# EAGLE design Top (EAGLE 9.6.2)
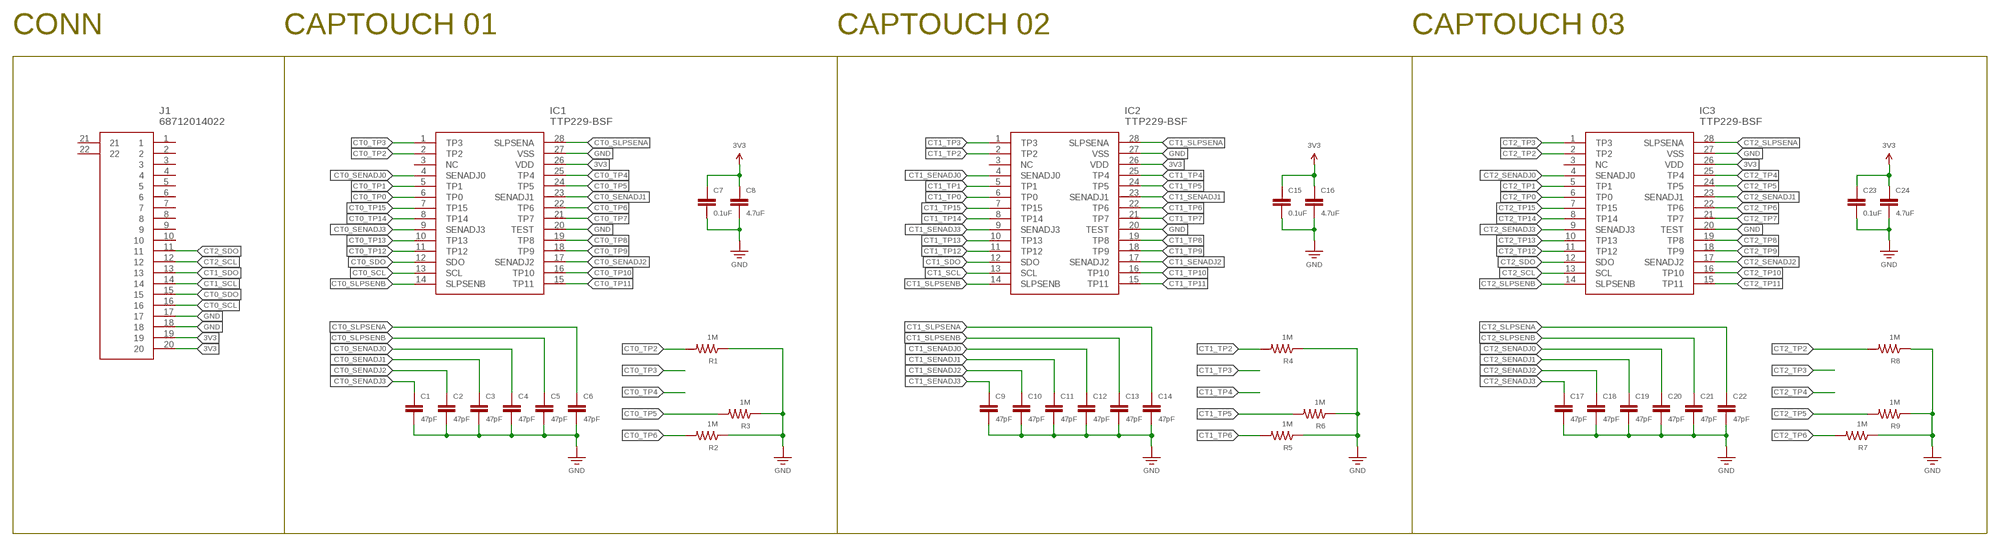
[diagram p0: schematic, sheet 1]

## Parts
C1  47pF  CAP-0603  [CAP-0603]
C2  47pF  CAP-0603  [CAP-0603]
C3  47pF  CAP-0603  [CAP-0603]
C4  47pF  CAP-0603  [CAP-0603]
C5  47pF  CAP-0603  [CAP-0603]
C6  47pF  CAP-0603  [CAP-0603]
C7  0.1uF  CAP-0603  [CAP-0603]
C8  4.7uF  CAP-0603  [CAP-0603]
C9  47pF  CAP-0603  [CAP-0603]
C10  47pF  CAP-0603  [CAP-0603]
C11  47pF  CAP-0603  [CAP-0603]
C12  47pF  CAP-0603  [CAP-0603]
C13  47pF  CAP-0603  [CAP-0603]
C14  47pF  CAP-0603  [CAP-0603]
C15  0.1uF  CAP-0603  [CAP-0603]
C16  4.7uF  CAP-0603  [CAP-0603]
C17  47pF  CAP-0603  [CAP-0603]
C18  47pF  CAP-0603  [CAP-0603]
C19  47pF  CAP-0603  [CAP-0603]
C20  47pF  CAP-0603  [CAP-0603]
C21  47pF  CAP-0603  [CAP-0603]
C22  47pF  CAP-0603  [CAP-0603]
C23  0.1uF  CAP-0603  [CAP-0603]
C24  4.7uF  CAP-0603  [CAP-0603]
IC1  TTP229-BSF  [SOP64P600X175-28N]
IC2  TTP229-BSF  [SOP64P600X175-28N]
IC3  TTP229-BSF  [SOP64P600X175-28N]
J1  68712014022  [68712014022]
R1  1M  RES-0603  [RES-0603]
R2  1M  RES-0603  [RES-0603]
R3  1M  RES-0603  [RES-0603]
R4  1M  RES-0603  [RES-0603]
R5  1M  RES-0603  [RES-0603]
R6  1M  RES-0603  [RES-0603]
R7  1M  RES-0603  [RES-0603]
R8  1M  RES-0603  [RES-0603]
R9  1M  RES-0603  [RES-0603]

## Nets
3V3: C7.P$1 C8.P$1 C15.P$1 C16.P$1 C23.P$1 C24.P$1 IC1.26(VDD) IC2.26(VDD) IC3.26(VDD) J1.19 J1.20
CT0_SCL: IC1.13(SCL) J1.16
CT0_SDO: IC1.12(SDO) J1.15
CT0_SENADJ0: C4.P$1 IC1.4(SENADJ0)
CT0_SENADJ1: C3.P$1 IC1.23(SENADJ1)
CT0_SENADJ2: C2.P$1 IC1.17(SENADJ2)
CT0_SENADJ3: C1.P$1 IC1.9(SENADJ3)
CT0_SLPSENA: C6.P$1 IC1.28(SLPSENA)
CT0_SLPSENB: C5.P$1 IC1.14(SLPSENB)
CT0_TP0: IC1.6(TP0)
CT0_TP1: IC1.5(TP1)
CT0_TP2: IC1.2(TP2) R1.P$2
CT0_TP3: IC1.1(TP3)
CT0_TP4: IC1.25(TP4)
CT0_TP5: IC1.24(TP5) R3.P$2
CT0_TP6: IC1.22(TP6) R2.P$2
CT0_TP7: IC1.21(TP7)
CT0_TP8: IC1.19(TP8)
CT0_TP9: IC1.18(TP9)
CT0_TP10: IC1.16(TP10)
CT0_TP11: IC1.15(TP11)
CT0_TP12: IC1.11(TP12)
CT0_TP13: IC1.10(TP13)
CT0_TP14: IC1.8(TP14)
CT0_TP15: IC1.7(TP15)
CT1_SCL: IC2.13(SCL) J1.14
CT1_SDO: IC2.12(SDO) J1.13
CT1_SENADJ0: C12.P$1 IC2.4(SENADJ0)
CT1_SENADJ1: C11.P$1 IC2.23(SENADJ1)
CT1_SENADJ2: C10.P$1 IC2.17(SENADJ2)
CT1_SENADJ3: C9.P$1 IC2.9(SENADJ3)
CT1_SLPSENA: C14.P$1 IC2.28(SLPSENA)
CT1_SLPSENB: C13.P$1 IC2.14(SLPSENB)
CT1_TP0: IC2.6(TP0)
CT1_TP1: IC2.5(TP1)
CT1_TP2: IC2.2(TP2) R4.P$2
CT1_TP3: IC2.1(TP3)
CT1_TP4: IC2.25(TP4)
CT1_TP5: IC2.24(TP5) R6.P$2
CT1_TP6: IC2.22(TP6) R5.P$2
CT1_TP7: IC2.21(TP7)
CT1_TP8: IC2.19(TP8)
CT1_TP9: IC2.18(TP9)
CT1_TP10: IC2.16(TP10)
CT1_TP11: IC2.15(TP11)
CT1_TP12: IC2.11(TP12)
CT1_TP13: IC2.10(TP13)
CT1_TP14: IC2.8(TP14)
CT1_TP15: IC2.7(TP15)
CT2_SCL: IC3.13(SCL) J1.12
CT2_SDO: IC3.12(SDO) J1.11
CT2_SENADJ0: C20.P$1 IC3.4(SENADJ0)
CT2_SENADJ1: C19.P$1 IC3.23(SENADJ1)
CT2_SENADJ2: C18.P$1 IC3.17(SENADJ2)
CT2_SENADJ3: C17.P$1 IC3.9(SENADJ3)
CT2_SLPSENA: C22.P$1 IC3.28(SLPSENA)
CT2_SLPSENB: C21.P$1 IC3.14(SLPSENB)
CT2_TP0: IC3.6(TP0)
CT2_TP1: IC3.5(TP1)
CT2_TP2: IC3.2(TP2) R8.P$2
CT2_TP3: IC3.1(TP3)
CT2_TP4: IC3.25(TP4)
CT2_TP5: IC3.24(TP5) R9.P$2
CT2_TP6: IC3.22(TP6) R7.P$2
CT2_TP7: IC3.21(TP7)
CT2_TP8: IC3.19(TP8)
CT2_TP9: IC3.18(TP9)
CT2_TP10: IC3.16(TP10)
CT2_TP11: IC3.15(TP11)
CT2_TP12: IC3.11(TP12)
CT2_TP13: IC3.10(TP13)
CT2_TP14: IC3.8(TP14)
CT2_TP15: IC3.7(TP15)
GND: C1.P$2 C2.P$2 C3.P$2 C4.P$2 C5.P$2 C6.P$2 C7.P$2 C8.P$2 C9.P$2 C10.P$2 C11.P$2 C12.P$2 C13.P$2 C14.P$2 C15.P$2 C16.P$2 C17.P$2 C18.P$2 C19.P$2 C20.P$2 C21.P$2 C22.P$2 C23.P$2 C24.P$2 IC1.20(TEST) IC1.27(VSS) IC2.20(TEST) IC2.27(VSS) IC3.20(TEST) IC3.27(VSS) J1.17 J1.18 R1.P$1 R2.P$1 R3.P$1 R4.P$1 R5.P$1 R6.P$1 R7.P$1 R8.P$1 R9.P$1
Unconnected: IC1.3(NC) IC2.3(NC) IC3.3(NC) J1.1 J1.2 J1.3 J1.4 J1.5 J1.6 J1.7 J1.8 J1.9 J1.10 J1.21 J1.22

## Notes on the sheet
- CONN | CAPTOUCH 01 | CAPTOUCH 02 | CAPTOUCH 03

## Library data of the parts
C1-C24 = Capacitor:CAP-0603
IC1-IC3 = RandomWaves:TTP229-BSF: TOUCH PAD DETECTOR IC Source: Datasheet <http://www.tontek.com.tw/download.asp?sn=726>; DESCRIPTION: TOUCH PAD DETECTOR IC; HEIGHT: 1.75mm; MANUFACTURER_NAME: TONTEK; MANUFACTURER_PART_NUMBER: TTP229-BSF
J1 = RandomWaves:68712014022: Wurth Elektronik 687 Series 0.5mm 20 Way 1 Row Straight PCB Socket Surface Mount Wire to Board Source: Datasheet <https://katalog.we-online.de/em/datasheet/6871xx14022.pdf>; DESCRIPTION: Wurth Elektronik 687 Series 0.5mm 20 Way 1 Row Straight PCB Socket Surface Mount Wire to Board; HEIGHT: 2.1mm; MANUFACTURER_NAME: Wurth Elektronik; MANUFACTURER_PART_NUMBER: 68712014022; MOUSER_PART_NUMBER: 710-68712014022; MOUSER_PRICE-STOCK: https://www.mouser.co.uk/ProductDetail/Wurth-Elektronik/68712014022?qs=ZtY9WdtwX57%2F0bEhtjzEjA%3D%3D
R1-R9 = Resistor:RES-0603

## Board
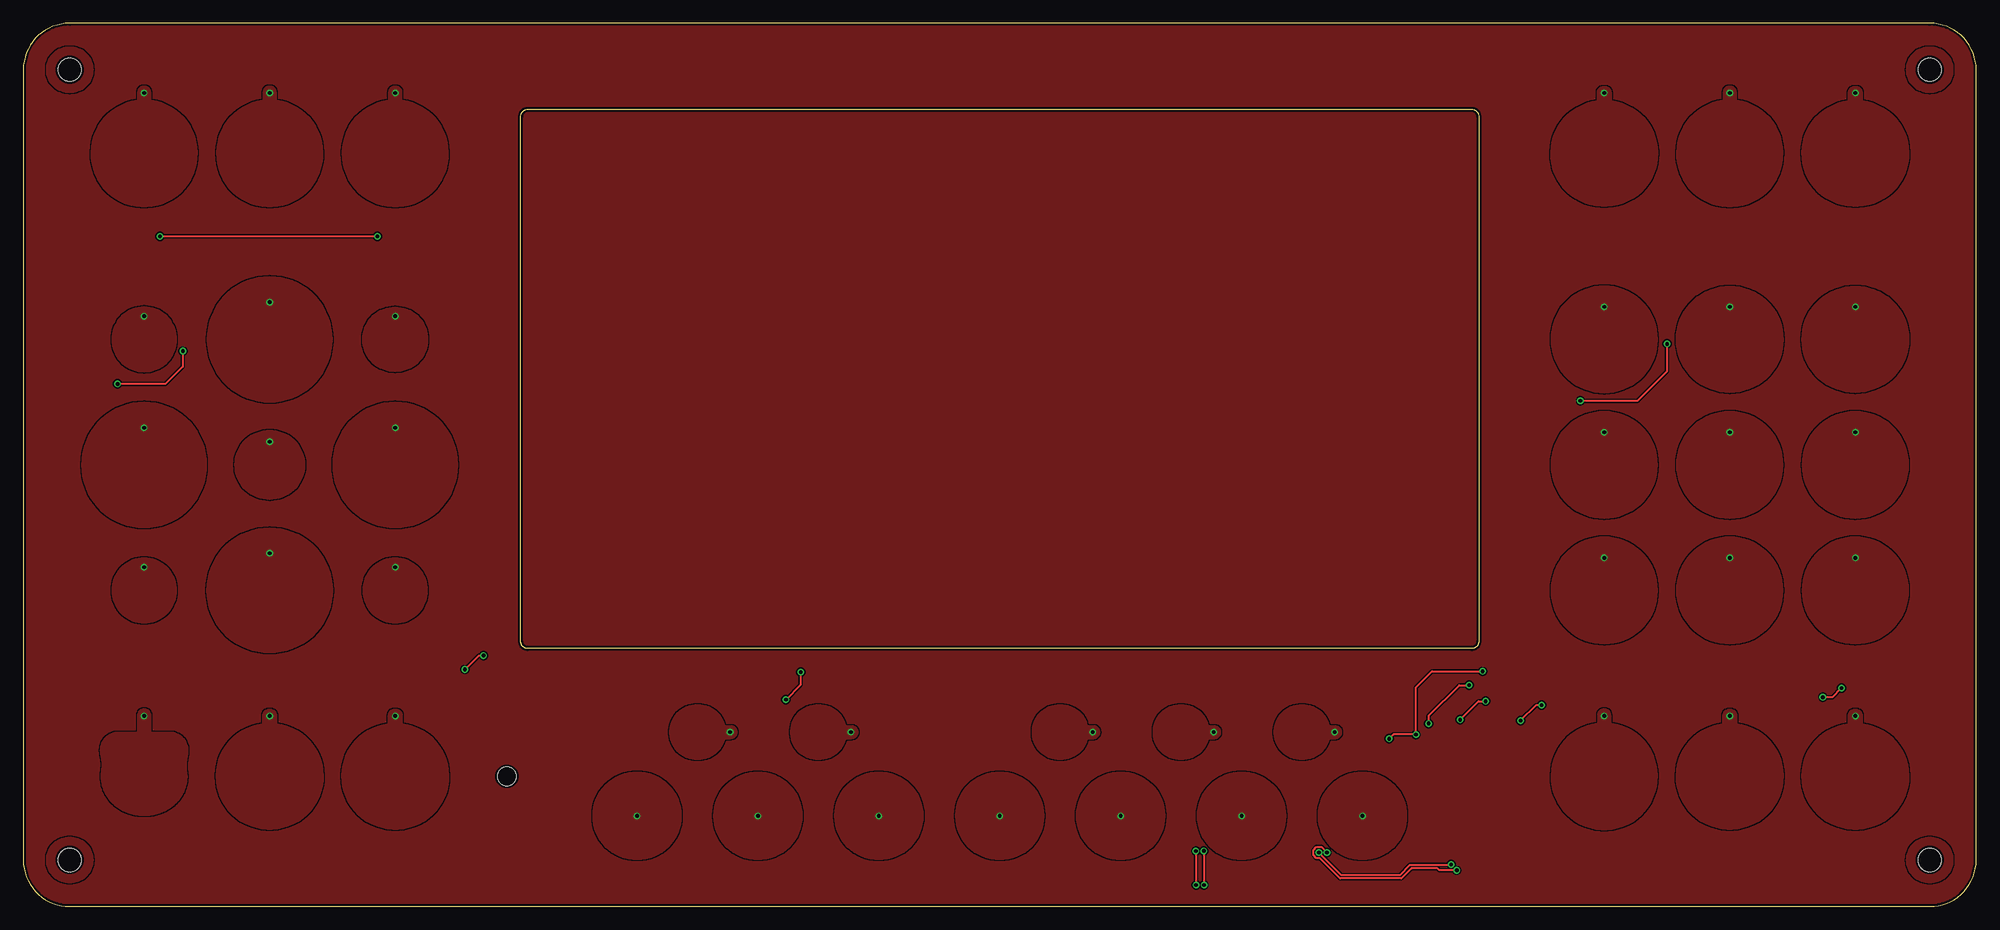
[diagram p1: board, top side]
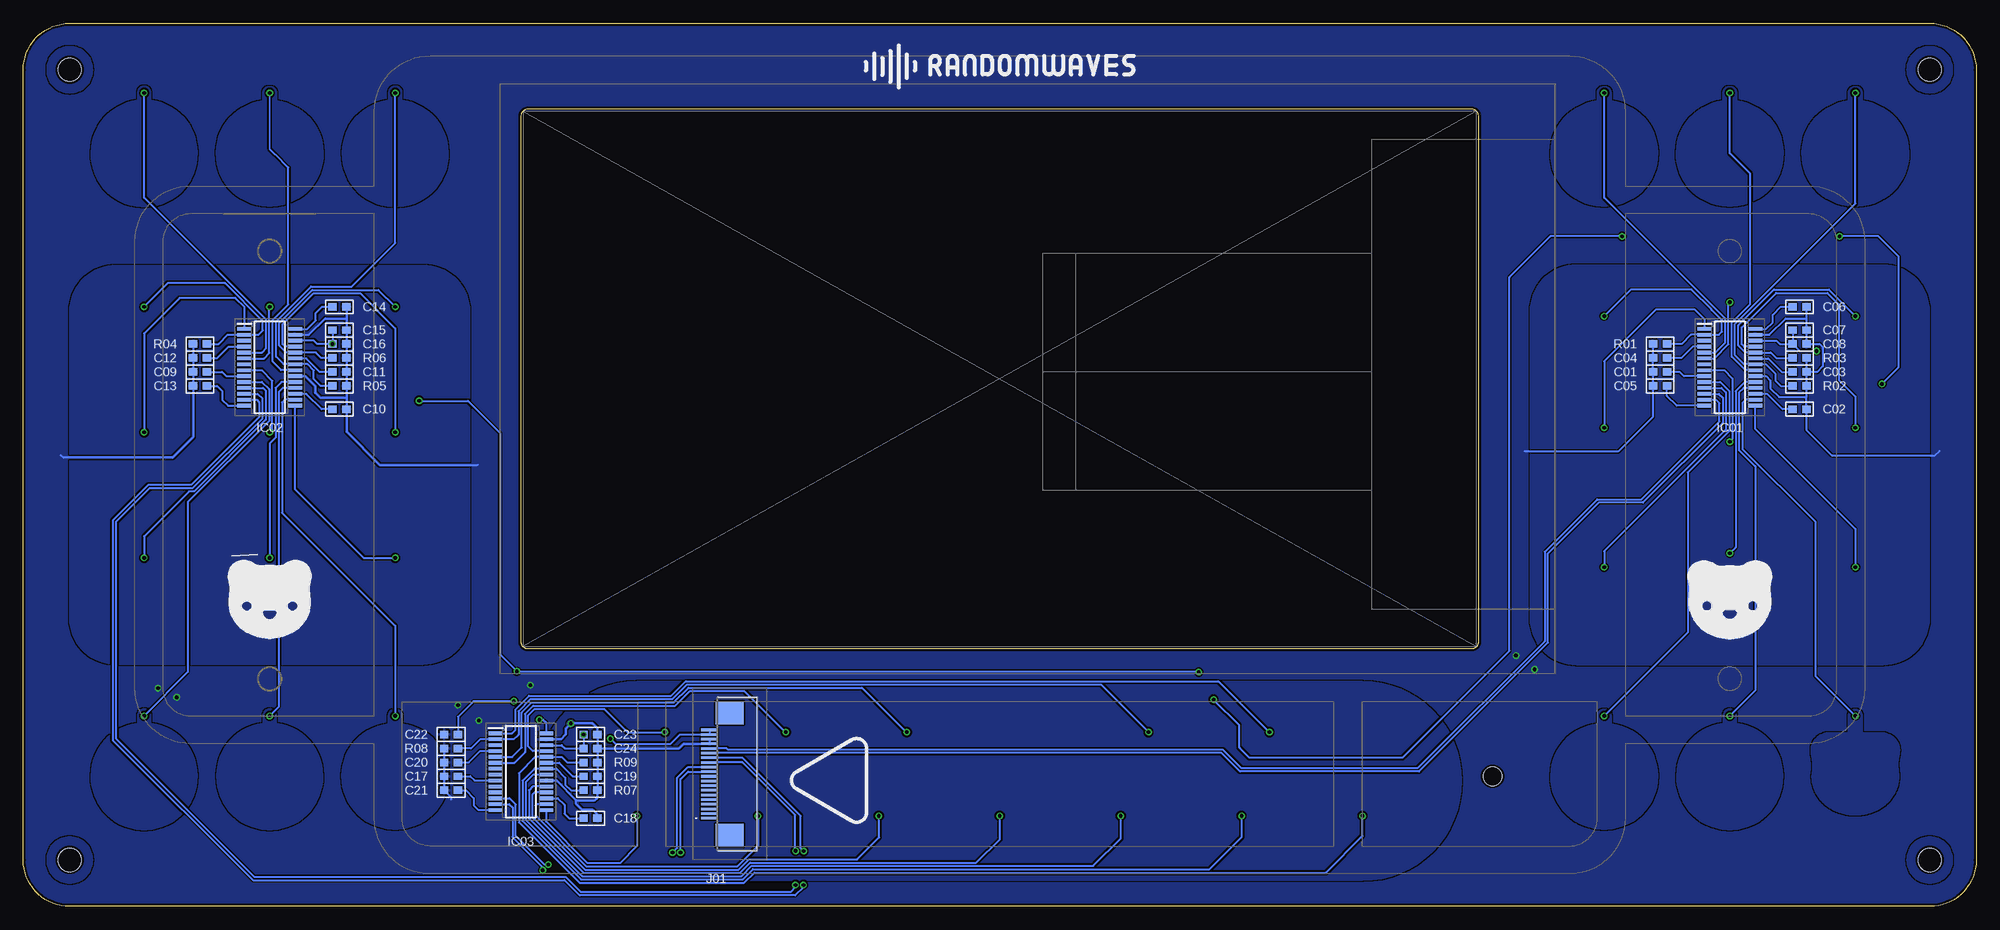
[diagram p2: board, bottom side, seen from below]

Size 210 x 95 mm. Coordinates in mm from the lower left corner, seen from the top.
Outline: 0,90 0,5 arc90 5,0 205,0 arc90 210,5 210,90 arc90 205,95 5,95 arc90 0,90
Outline: 54.25,85.75 155.75,85.75 arc-90 156.5,85 156.5,28.5 arc-90 155.75,27.75 54.25,27.75 arc-90 53.5,28.5 53.5,85 arc-90 54.25,85.75
Copper layers (1*16): Top 0.035mm / dielectric 1.5mm / Bottom 0.035mm
Design rules "ITEADstudio_DRC": minimum track width 6mil, minimum drill 12mil, track to track 6mil, track to pad 6mil, pad to pad 6mil, via to via 6mil, smd to smd 0mil, copper to edge 10mil, drill to drill 10mil, minimum pad ring 10mil, minimum via ring 6mil, stop-mask expansion 2mil, vias tented up to drill 100mil, thermal gap 10mil
Holes 2.5 mm at 5,90 205,90 205,5 5,5
Holes 2 mm at 52,14

### Footprints (pad centres in the part's own frame; a part is rotated, then mirrored left to right if it is on the bottom)
CAP-0603 = smd 0.9 x 0.8: P$1 -0.75,0; P$2 0.75,0
SOP64P600X175-28N = smd 1.525 x 0.4: 1 -2.712,4.128; 2 -2.712,3.492; 3 -2.712,2.858; 4 -2.712,2.222; 5 -2.712,1.588; 6 -2.712,0.952; 7 -2.712,0.318; 8 -2.712,-0.318; 9 -2.712,-0.952; 10 -2.712,-1.588; 11 -2.712,-2.222; 12 -2.712,-2.858; 13 -2.712,-3.492; 14 -2.712,-4.128; 15 2.712,-4.128; 16 2.712,-3.492; 17 2.712,-2.858; 18 2.712,-2.222; 19 2.712,-1.588; 20 2.712,-0.952; 21 2.712,-0.318; 22 2.712,0.318; 23 2.712,0.952; 24 2.712,1.588; 25 2.712,2.222; 26 2.712,2.858; 27 2.712,3.492; 28 2.712,4.128
68712014022 = smd 0.275 x 1.8: 1 -4.75,2.72; 2 -4.25,2.72; 3 -3.75,2.72; 4 -3.25,2.72; 5 -2.75,2.72; 6 -2.25,2.72; 7 -1.75,2.72; 8 -1.25,2.72; 9 -0.75,2.72; 10 -0.25,2.72; 11 0.25,2.72; 12 0.75,2.72; 13 1.25,2.72; 14 1.75,2.72; 15 2.25,2.72; 16 2.75,2.72; 17 3.25,2.72; 18 3.75,2.72; 19 4.25,2.72; 20 4.75,2.72 | smd 2.5 x 3: 21 -6.58,0.56; 22 6.58,0.56
RES-0603 = smd 0.9 x 0.8: P$1 -0.75,0; P$2 0.75,0

### Placement (x,y rotation side)
C1  34,57.5 180 bottom
C2  19,53.5 0 bottom
C3  19,57.5 0 bottom
C4  34,59 180 bottom
C5  34,56 180 bottom
C6  19,64.5 0 bottom
C7  19,62 0 bottom
C8  19,60.5 0 bottom
C9  191,57.5 180 bottom
C10  176,53.5 0 bottom
C11  176,57.5 0 bottom
C12  191,59 180 bottom
C13  191,56 180 bottom
C14  176,64.5 0 bottom
C15  176,62 0 bottom
C16  176,60.5 0 bottom
C17  164,14 180 bottom
C18  149,9.5 0 bottom
C19  149,14 0 bottom
C20  164,15.5 180 bottom
C21  164,12.5 180 bottom
C22  164,18.5 180 bottom
C23  149,18.5 0 bottom
C24  149,17 0 bottom
IC1  26.5,58 0 bottom
IC2  183.5,58 0 bottom
IC3  156.5,14.5 0 bottom
J1  133.5,14.25 90 bottom
R1  34,60.5 0 bottom
R2  19,56 180 bottom
R3  19,59 180 bottom
R4  191,60.5 0 bottom
R5  176,56 180 bottom
R6  176,59 180 bottom
R7  149,12.5 180 bottom
R8  164,17 0 bottom
R9  149,15.5 180 bottom

### Tracks (layer width: path | path; a pad name or v marks a point on that pad's centre or on a via)
3V3  (via drill 0.4)
  Top 0.2: C16.P$1 176.75,57.55 173.58,54.38 v167.43,54.38 | v17.16,59.74 17.16,58.07 15.29,56.2 v10.15,56.2 | v14.71,72.09 v38.07,72.09 | v83.6,25.21 83.6,23.84 v82.01,22.25 | v146.87,18.04 147.33,18.5 C23.P$1 149.75,23.57 151.47,25.29 v156.91,25.29
  Bottom 0.2: C7.P$1 C8.P$1 | C15.P$1 C16.P$1 178.41,60.5 178.77,60.86 IC2.26 | v167.43,54.38 162.17,54.38 158.74,50.95 158.74,27.12 v156.91,25.29 83.68,25.29 v83.6,25.21 | C8.P$1 21.12,60.5 21.48,60.86 IC1.26 | C8.P$1 19,59.75 v17.17,59.75 v17.16,59.74 | C23.P$1 C24.P$1 151.74,17 | IC3.26 152.1,17.36 151.74,17 | v10.15,56.2 8.34,58.01 8.34,69.92 10.51,72.09 v14.71,72.09 | v38.07,72.09 45.78,72.09 50.18,67.69 50.18,27.51 61.7,15.99 78.15,15.99 79.17,17.01 79.17,17.02 79.27,17.12 79.27,19.51 v82.01,22.25 | J1.20 J1.19 139.39,18.5 140.39,17.5 146.33,17.5 v146.87,18.04 | 151.74,17
  other vias: 176.75,60.5 149.75,18.5
CT0_SCL
  Bottom 0.2: IC1.13 27.98,54.51 27.62,54.15 27.62,52.16 35.99,43.8 40.75,43.8 46.41,38.14 46.41,28.53 60.07,14.87 79.02,14.87 81,16.85 134.22,16.85 134.37,17 J1.16
CT0_SDO
  Bottom 0.2: IC1.12 27.67,55.14 27.27,54.74 27.27,52.02 35.84,43.45 40.6,43.45 46.06,37.99 46.06,28.38 59.92,14.52 79.17,14.52 81.15,16.5 J1.15
CT0_SENADJ0
  Bottom 0.2: IC1.4 30.49,60.22 31.71,59 C4.P$1
CT0_SENADJ1
  Bottom 0.2: IC1.23 22.36,58.95 20.91,57.5 C3.P$1
CT0_SENADJ2
  Bottom 0.2: C2.P$1 20.85,53.5 22.49,55.14 IC1.17
CT0_SENADJ3
  Bottom 0.2: IC1.9 31.43,57.05 31.88,57.5 C1.P$1
CT0_SLPSENA
  Bottom 0.2: IC1.28 22.6,62.13 21.9,62.83 21.9,63.62 21.02,64.5 C6.P$1
CT0_SLPSENB
  Bottom 0.2: IC1.14 32.2,53.87 33.25,54.92 C5.P$1
CT0_TP0  (via drill 0.4)
  Bottom 0.2: IC1.6 28.17,58.95 26.64,60.48 26.64,64.86 v26.5,65
  pour Top (isolate 0.2): 26.5,67.75 arc90 19.75,61 arc90 26.5,54.25 arc90 33.25,61 arc90
CT0_TP1  (via drill 0.4)
  Bottom 0.2: IC1.5 28.03,59.59 26.99,60.63 26.99,63.23 40,76.24 v40,87.5
  pour Top (isolate 0.2): 39.25,87.5 39.25,86.7 arc345 40.75,86.7 40.75,87.5 arc180
CT0_TP2  (via drill 0.4)
  Bottom 0.2: R1.P$2 31.67,60.5 30.68,61.49 IC1.2 27.67,61.49 27.34,61.82 27.34,63.08 28.38,64.12 28.51,64.25 30.62,66.36 37.14,66.36 v40,63.5
  pour Top (isolate 0.2): 40,57.5 arc-90 36.5,61 arc-90 40,64.5 arc-90 43.5,61 arc-90
CT0_TP3  (via drill 0.4)
  Bottom 0.2: IC1.1 29.21,63.15 30.24,64.18 34.48,64.18 40,58.66 v40,51.5
  pour Top (isolate 0.2): 40,54.25 arc90 33.25,47.5 arc90 40,40.75 arc90 46.75,47.5 arc90
CT0_TP4  (via drill 0.4)
  Bottom 0.2: IC1.25 24.96,60.22 25.23,60.49 25.23,62.28 21.51,66 16,66 14.76,64.76 14.76,56.63 13,54.87 v13,51.5
  pour Top (isolate 0.2): 13,54.25 arc90 6.25,47.5 arc90 13,40.75 arc90 19.75,47.5 arc90
CT0_TP5  (via drill 0.4)
  Bottom 0.2: R3.P$2 21.51,59 22.1,59.59 IC1.24 24.83,59.59 25.58,60.34 25.58,62.52 21.75,66.35 15.85,66.35 v13,63.5
  pour Top (isolate 0.2): 13,64.5 arc90 9.5,61 arc90 13,57.5 arc90 16.5,61 arc90
CT0_TP6  (via drill 0.4)
  Bottom 0.2: R2.P$2 21.04,56 21.6,56.56 21.6,57.31 22.61,58.32 IC1.22 24.97,58.32 25.94,59.28 25.94,62.66 13,75.6 v13,87.5
  pour Top (isolate 0.2): 12.25,87.5 12.25,86.7 arc345 13.75,86.7 13.75,87.5 arc180
CT0_TP7  (via drill 0.4)
  Bottom 0.2: IC1.21 24.83,57.68 26.29,59.14 26.29,62.81 24.32,64.78 24.32,78.82 26.5,81 v26.5,87.5
  pour Top (isolate 0.2): 25.75,87.5 25.75,86.7 arc345 27.25,86.7 27.25,87.5 arc180
CT0_TP8  (via drill 0.4)
  Bottom 0.2: IC1.19 24.87,56.41 25.86,55.42 25.86,38.64 v26.5,38
  pour Top (isolate 0.2): 26.5,27.25 arc-90 19.75,34 arc-90 26.5,40.75 arc-90 33.25,34 arc-90
CT0_TP9  (via drill 0.4)
  Bottom 0.2: IC1.18 25,55.78 25.51,55.27 25.51,49.11 23.74,47.34 23.74,23.26 v26.5,20.5
  pour Top (isolate 0.2): 27.25,19.7 arc-345 25.75,19.7 25.75,20.5 arc-180 27.25,20.5
CT0_TP10  (via drill 0.4)
  Bottom 0.2: IC1.16 24.75,54.51 25.13,54.13 25.13,49.23 17.3,41.4 17.3,24.8 v13,20.5
  pour Top (isolate 0.2): 10.23,18.74 arc107 8.33,16.2 arc-21 8.36,14.36 8.36,14.32 8.35,14.28 8.34,14.19 8.34,14.12 8.34,14.04 8.34,13.94 8.34,13.85 8.35,13.76 8.36,13.66 8.36,13.57 8.38,13.47 8.39,13.36 8.41,13.25 8.44,13.15 8.46,13.05 8.49,12.95 8.52,12.85 8.55,12.76 8.58,12.66 8.62,12.57 8.66,12.47 8.7,12.39 8.73,12.31 8.78,12.23 8.82,12.14 8.86,12.06 8.91,11.99 8.96,11.91 9.01,11.83 9.06,11.75 9.12,11.67 9.18,11.59 9.24,11.52 9.3,11.44 9.37,11.37 9.43,11.3 9.5,11.22 9.57,11.16 9.64,11.09 9.71,11.02 9.78,10.96 9.86,10.89 9.93,10.83 10.01,10.77 10.09,10.72 10.17,10.66 10.25,10.61 10.33,10.55 10.41,10.5 10.5,10.45 10.58,10.4 10.67,10.36 10.75,10.31 10.84,10.27 10.93,10.23 11.02,10.19 11.11,10.16 11.2,10.12 11.29,10.09 11.38,10.06 11.47,10.03 11.57,10 11.66,9.97 11.75,9.95 11.85,9.93 11.94,9.9 12.04,9.89 12.13,9.87 12.23,9.85 12.32,9.84 12.42,9.83 12.52,9.82 12.61,9.81 12.71,9.8 12.81,9.8 12.9,9.8 13,9.8 13.1,9.8 13.19,9.8 13.29,9.8 13.39,9.81 13.48,9.82 13.58,9.83 13.68,9.84 13.77,9.85 13.87,9.87 13.96,9.89 14.06,9.9 14.15,9.93 14.25,9.95 14.34,9.97 14.43,10 14.52,10.03 14.62,10.06 14.71,10.09 14.8,10.12 14.89,10.16 14.98,10.19 15.07,10.23 15.16,10.27 15.24,10.31 15.33,10.36 15.42,10.4 15.5,10.45 15.59,10.5 15.67,10.55 15.75,10.6 15.83,10.66 15.91,10.72 15.99,10.77 16.07,10.83 16.14,10.89 16.22,10.96 16.29,11.02 16.36,11.09 16.43,11.16 16.5,11.22 16.57,11.29 16.63,11.37 16.7,11.44 16.76,11.52 16.82,11.59 16.88,11.67 16.94,11.75 16.99,11.83 17.04,11.91 17.1,12 17.15,12.08 17.19,12.17 17.24,12.25 17.28,12.34 17.31,12.41 17.34,12.47 17.38,12.57 17.42,12.66 17.45,12.76 17.48,12.85 17.51,12.95 17.54,13.05 17.56,13.15 17.58,13.25 17.61,13.37 17.62,13.47 17.63,13.57 17.64,13.66 17.65,13.76 17.66,13.85 17.66,13.94 17.66,14.04 17.66,14.12 17.65,14.19 17.65,14.28 17.64,14.32 17.64,14.36 arc-21 17.67,16.2 arc106 15.77,18.74 13.75,18.74 13.75,20.5 arc180 12.25,20.5 12.25,18.74
CT0_TP11  (via drill 0.4)
  Bottom 0.2: IC1.15 23.79,51.4 13,40.61 v13,36.5
  pour Top (isolate 0.2): 13,37.5 arc90 9.5,34 arc90 13,30.5 arc90 16.5,34 arc90
CT0_TP12  (via drill 0.4)
  Bottom 0.2: IC1.11 27.4,55.78 26.92,55.3 26.92,51.3 40,38.22 v40,36.5
  pour Top (isolate 0.2): 40,37.5 arc90 36.5,34 arc90 40,30.5 arc90 43.5,34 arc90
CT0_TP13  (via drill 0.4)
  Bottom 0.2: IC1.10 27.53,56.41 26.57,55.45 26.57,51.15 31.03,46.69 31.03,29.47 v40,20.5
  pour Top (isolate 0.2): 40.75,19.7 arc-345 39.25,19.7 39.25,20.5 arc-180 40.75,20.5
CT0_TP14  (via drill 0.4)
  Bottom 0.2: IC1.8 27.11,57.68 26.22,56.78 26.22,50.28 v26.5,50
  pour Top (isolate 0.2): 26.5,43.75 arc-90 22.75,47.5 arc-90 26.5,51.25 arc-90 30.25,47.5 arc-90
CT1_SCL  (via drill 0.4)
  Top 0.2: v126.09,5.97 v126.09,2.31 v126.1,2.3
  Bottom 0.2: IC2.13 184.93,54.51 184.63,54.21 184.63,52.65 191.93,45.35 196.55,45.35 200.36,41.54 200.36,17.89 185.3,2.83 151.82,2.83 150.18,1.19 126.98,1.19 126.1,2.07 v126.1,2.3 | v126.09,5.97 126.34,6.22 126.34,6.23 126.39,6.28 126.39,9.73 132.66,16 J1.14
CT1_SDO  (via drill 0.4)
  Top 0.2: v126.95,5.98 v126.96,5.97 v126.96,2.31
  Bottom 0.2: IC2.12 184.79,55.14 184.27,54.62 184.27,52.51 191.78,45 196.4,45 200.01,41.39 200.01,18.04 185.15,3.18 151.67,3.18 150.03,1.54 127.52,1.54 126.96,2.1 v126.96,2.31 | v126.95,5.98 127,6.03 127,9.84 132.66,15.5 J1.13
CT1_SENADJ0
  Bottom 0.2: C12.P$1 189.12,59 187.9,60.22 IC2.4
CT1_SENADJ1
  Bottom 0.2: C11.P$1 178.1,57.5 179.55,58.95 IC2.23
CT1_SENADJ2
  Bottom 0.2: C10.P$1 177.92,53.5 179.56,55.14 IC2.17
CT1_SENADJ3
  Bottom 0.2: C9.P$1 188.62,57.5 188.17,57.05 IC2.9
CT1_SLPSENA
  Bottom 0.2: IC2.28 179.45,62.13 178.55,63.03 178.55,63.83 177.88,64.5 C14.P$1
CT1_SLPSENB
  Bottom 0.2: C13.P$1 189.15,56 188.59,55.44 188.59,54.48 187.98,53.87 IC2.14
CT1_TP0  (via drill 0.4)
  Bottom 0.2: IC2.6 184.12,58.95 183.53,59.54 183.53,64.47 v183.5,64.5
  pour Top (isolate 0.2): 183.5,55.25 arc-90 177.75,61 arc-90 183.5,66.75 arc-90 189.25,61 arc-90
CT1_TP1  (via drill 0.4)
  Bottom 0.2: IC2.5 184.33,59.59 183.88,60.04 183.88,63.12 197,76.24 v197,87.5
  pour Top (isolate 0.2): 197.75,86.7 arc-345 196.25,86.7 196.25,87.5 arc-180 197.75,87.5
CT1_TP2  (via drill 0.4)
  Bottom 0.2: R4.P$2 189,60.5 188.01,61.49 IC2.2 184.69,61.49 184.23,61.95 184.23,62.98 188.29,67.03 194.47,67.03 v197,64.5
  pour Top (isolate 0.2): 197,55.25 arc-90 191.25,61 arc-90 197,66.75 arc-90 202.75,61 arc-90
CT1_TP3  (via drill 0.4)
  Bottom 0.2: IC2.1 186.21,63.5 186.21,63.84 186.21,64.45 187.2,65.44 193.2,65.44 197,61.64 v197,51
  pour Top (isolate 0.2): 197,53.25 arc90 191.25,47.5 arc90 197,41.75 arc90 202.75,47.5 arc90
CT1_TP4  (via drill 0.4)
  Bottom 0.2: IC2.25 181.86,60.22 182.12,60.48 182.12,62.62 178.77,65.97 173.8,65.97 170,62.17 v170,51
  pour Top (isolate 0.2): 170,53.25 arc90 164.25,47.5 arc90 170,41.75 arc90 175.75,47.5 arc90
CT1_TP5  (via drill 0.4)
  Bottom 0.2: R6.P$2 177.95,59 178.54,59.59 IC2.24 181.73,59.59 182.47,60.33 182.47,62.77 178.92,66.32 171.82,66.32 v170,64.5
  pour Top (isolate 0.2): 170,66.75 arc90 164.25,61 arc90 170,55.25 arc90 175.75,61 arc90
CT1_TP6  (via drill 0.4)
  Bottom 0.2: R5.P$2 178.02,56 178.77,56.75 178.77,57.67 179.42,58.32 IC2.22 182.02,58.32 182.82,59.12 182.82,62.91 179.06,66.67 174.69,66.67 170,71.36 v170,87.5
  pour Top (isolate 0.2): 170.75,86.7 arc-345 169.25,86.7 169.25,87.5 arc-180 170.75,87.5
CT1_TP7  (via drill 0.4)
  Bottom 0.152: 181.49,79.49 182.87,80.87 182.89,80.87 183.5,81.48 v183.5,87.5
  Bottom 0.2: IC2.21 182.27,57.68 183.18,58.59 183.18,63.06 181.49,64.75 181.49,79.49
  pour Top (isolate 0.2): 182.75,87.5 182.75,86.7 arc345 184.25,86.7 184.25,87.5 arc180
CT1_TP8  (via drill 0.4)
  Bottom 0.2: IC2.19 182.22,56.41 182.87,55.77 182.87,50.42 183.5,49.79 v183.5,37.5
  pour Top (isolate 0.2): 183.5,39.75 arc90 177.75,34 arc90 183.5,28.25 arc90 189.25,34 arc90
CT1_TP9  (via drill 0.4)
  Bottom 0.2: IC2.18 182.08,55.78 182.51,55.35 182.51,21.49 v183.5,20.5
  pour Top (isolate 0.2): 184.25,19.7 arc-345 182.75,19.7 182.75,20.5 arc-180 184.25,20.5
CT1_TP10  (via drill 0.4)
  Bottom 0.2: IC2.16 181.87,54.51 182.16,54.22 182.16,42.35 170,30.19 v170,20.5
  pour Top (isolate 0.2): 169.25,20.5 169.25,19.7 arc345 170.75,19.7 170.75,20.5 arc180
CT1_TP11  (via drill 0.4)
  Bottom 0.2: v170,37.5 173.4,37.5 180.79,44.89 IC2.15
  pour Top (isolate 0.2): 170,39.75 arc90 164.25,34 arc90 170,28.25 arc90 175.75,34 arc90
CT1_TP12  (via drill 0.4)
  Bottom 0.2: IC2.11 184.21,55.78 183.92,55.49 183.92,52.36 191.64,44.65 192.18,44.65 197,39.83 v197,37.5
  pour Top (isolate 0.2): 197,39.75 arc90 191.25,34 arc90 197,28.25 arc90 202.75,34 arc90
CT1_TP13  (via drill 0.4)
  Bottom 0.2: IC2.10 184.34,56.41 183.57,55.64 183.57,52.22 192.29,43.49 192.29,25.21 v197,20.5
  pour Top (isolate 0.2): 197.75,19.7 arc-345 196.25,19.7 196.25,20.5 arc-180 197.75,20.5
CT1_TP14  (via drill 0.4)
  Bottom 0.2: IC2.8 184.36,57.68 183.22,56.54 183.22,51.28 v183.5,51
  pour Top (isolate 0.2): 183.5,53.25 arc90 177.75,47.5 arc90 183.5,41.75 arc90 189.25,47.5 arc90
CT2_SCL  (via drill 0.4)
  Top 0.2: v140.18,5.79 139.57,6.4 139.07,6.4 138.72,6.04 138.72,5.54 139.07,5.19 139.43,5.19 141.59,3.02 148.18,3.02 149.27,4.11 152.06,4.11 152.27,3.9 v154.15,3.9
  Bottom 0.2: IC3.13 157.73,11.01 157.39,10.67 157.39,7.5 157.39,7.44 154.15,4.2 v154.15,3.9 | v140.18,5.79 139.67,6.29 139.67,13.84 138.51,15 J1.12
CT2_SDO  (via drill 0.4)
  Top 0.2: v139.32,5.79 141.74,3.37 148.03,3.37 149.12,4.46 153.5,4.46 v153.54,4.5
  Bottom 0.2: IC3.12 157.7,11.64 157.04,10.98 157.04,7.59 153.95,4.5 v153.54,4.5 | J1.11 138.51,14.5 139.32,13.69 v139.32,5.79
CT2_SENADJ0
  Bottom 0.2: C20.P$1 162.09,15.5 160.87,16.72 IC3.4
CT2_SENADJ1
  Bottom 0.2: IC3.23 152.37,15.45 150.92,14 C19.P$1
CT2_SENADJ2
  Bottom 0.2: IC3.17 152.53,11.64 151.8,10.91 151.8,9.99 151.31,9.5 C18.P$1
CT2_SENADJ3
  Bottom 0.2: C17.P$1 161.93,14 161.48,13.55 IC3.9
CT2_SLPSENA  (via drill 0.4)
  Top 0.2: v154.5,20.08 156.49,22.07 v157.25,22.07
  Bottom 0.2: v154.5,20.08 154.08,20.08 153.79,19.79 IC3.28 | v157.25,22.07 161.59,22.07 163.25,20.41 C22.P$1
CT2_SLPSENB
  Bottom 0.2: C21.P$1 162.39,12.5 161.55,11.66 161.55,10.86 161.06,10.37 IC3.14
CT2_TP0  (via drill 0.4)
  Bottom 0.2: IC3.6 157.19,15.45 156.05,16.59 156.05,20.72 155.17,21.6 139.9,21.6 138.32,23.18 132.47,23.18 128.04,18.75 v128,18.75
  pour Top (isolate 0.2): 128,18 127.4,18 arc-331 127.4,19.5 128,19.5 arc-180
CT2_TP1  (via drill 0.4)
  Bottom 0.2: IC3.5 157.42,16.09 156.41,17.1 156.41,20.86 155.31,21.95 140.05,21.95 138.47,23.53 119.81,23.53 115.03,18.75 v115,18.75
  pour Top (isolate 0.2): 115,18 114.4,18 arc-331 114.4,19.5 115,19.5 arc-180
CT2_TP2  (via drill 0.4)
  Bottom 0.2: R8.P$2 161.85,17 160.86,17.99 IC3.2 157.25,17.99 156.76,18.48 156.76,21.01 155.46,22.3 140.19,22.3 138.61,23.89 94.12,23.89 v89,18.76 v89,18.75
  pour Top (isolate 0.2): 89,18 88.4,18 arc-331 88.4,19.5 89,19.5 arc-180
CT2_TP3  (via drill 0.4)
  Bottom 0.2: IC3.1 157.45,18.63 157.11,18.97 157.11,21.15 155.61,22.66 140.34,22.66 138.76,24.24 81.49,24.24 v76,18.75
  pour Top (isolate 0.2): 76,18 75.4,18 arc-331 75.4,19.5 76,19.5 arc-180
CT2_TP4  (via drill 0.4)
  Bottom 0.2: IC3.25 155.22,16.72 155.7,17.2 155.7,20.57 155.02,21.25 147.54,21.25 145.04,18.75 v141,18.75
  pour Top (isolate 0.2): 141,18 140.4,18 arc-331 140.4,19.5 141,19.5 arc-180
CT2_TP5  (via drill 0.4)
  Bottom 0.2: R9.P$2 151.52,15.5 152.11,16.09 IC3.24 154.94,16.09 156.68,14.35 156.68,9.05 150.19,2.56 132.48,2.56 131.38,3.65 69.94,3.65 65.99,7.6 v65.99,9.74 v66,9.75
  pour Top (isolate 0.2): 70.75,9.75 arc-180 61.25,9.75 arc-180
CT2_TP6  (via drill 0.4)
  Bottom 0.2: R7.P$2 151.11,12.5 151.71,13.1 151.71,13.86 152.67,14.82 IC3.22 155.03,14.82 156.33,13.52 156.33,9.2 150.04,2.91 132.63,2.91 131.53,4 82.43,4 78.96,7.47 78.96,9.71 v79,9.75
  pour Top (isolate 0.2): 83.75,9.75 arc-180 74.25,9.75 arc-180
CT2_TP7  (via drill 0.4)
  Bottom 0.2: IC3.21 155.17,14.18 155.98,13.37 155.98,9.34 149.89,3.26 132.77,3.26 131.68,4.35 94.95,4.35 91.97,7.34 91.97,9.72 v92,9.75
  pour Top (isolate 0.2): 96.75,9.75 arc-180 87.25,9.75 arc-180
CT2_TP8  (via drill 0.4)
  Bottom 0.2: IC3.19 155.22,12.91 155.62,12.51 155.62,9.49 149.75,3.61 132.92,3.61 131.82,4.71 107.54,4.71 105,7.25 v105,9.75
  pour Top (isolate 0.2): 109.75,9.75 arc-180 100.25,9.75 arc-180
CT2_TP9  (via drill 0.4)
  Bottom 0.2: IC3.18 155.02,12.28 155.27,12.03 155.27,9.64 149.6,3.97 133.06,3.97 131.97,5.06 120.34,5.06 117.96,7.44 117.96,9.71 v118,9.75
  pour Top (isolate 0.2): 122.75,9.75 arc-180 113.25,9.75 arc-180
CT2_TP10  (via drill 0.4)
  Bottom 0.2: IC3.16 154.74,11.01 154.92,10.83 154.92,9.78 149.46,4.32 133.21,4.32 130.96,6.57 130.96,9.71 v131,9.75
  pour Top (isolate 0.2): 135.75,9.75 arc-180 126.25,9.75 arc-180
CT2_TP11  (via drill 0.4)
  Bottom 0.2: IC3.15 153.79,9.15 149.31,4.67 145.85,4.67 144,6.52 v144,9.75
  pour Top (isolate 0.2): 148.75,9.75 arc-180 139.25,9.75 arc-180
GND  (via drill 0.4)
  Top 0.2: v47.5,25.5 49,27 v49.5,27 | v195.5,23.5 194.5,22.5 v193.5,22.5 | v163.25,21.65 162.65,21.65 v161,20 | v151.11,19.69 151.11,20.5 154.41,23.8 v155.46,23.8
  Bottom 0.2: R3.P$1 C3.P$2 | C3.P$2 R2.P$1 18.25,54.77 | IC1.20 22.58,57.05 22.12,56.59 22.12,55.7 21.19,54.77 18.25,54.77 | C6.P$2 18.25,63.24 | 18.25,63.24 C7.P$2 C8.P$2 16.84,60.5 16.49,60.15 16.49,58.12 17.11,57.5 C3.P$2 | 18.25,63.24 20.5,63.24 22.25,61.49 IC1.27 | R1.P$1 C4.P$2 C1.P$2 C5.P$2 34.75,52.67 38.46,48.96 48.55,48.96 | 175.25,54.75 R5.P$1 C11.P$2 R6.P$1 C16.P$2 C15.P$2 175.25,63.26 | 175.25,54.75 C10.P$2 175.25,51.07 171.68,47.5 161.12,47.5 | C14.P$2 175.25,63.26 | R4.P$1 C12.P$2 C9.P$2 C13.P$2 191.75,50.47 193.94,48.28 205.7,48.28 205.98,48.56 | IC2.20 179.68,57.05 178.62,55.99 178.62,55.27 178.1,54.75 175.25,54.75 | IC2.27 179.29,61.49 177.52,63.26 175.25,63.26 | 3.95,49 4.44,48.51 15.53,48.51 18.25,51.23 C2.P$2 18.25,54.77 | IC3.27 152.18,17.99 151.68,18.49 151.68,19.12 v151.11,19.69 148.79,19.69 148.25,19.15 C23.P$2 C24.P$2 | C24.P$2 R9.P$1 C19.P$2 R7.P$1 148.25,11.71 148.54,11.42 150.53,11.42 | IC3.20 152.66,13.55 150.53,11.42 | C18.P$2 148.25,9.88 148.79,10.42 149.91,10.42 150.53,11.04 150.53,11.42 | J1.18 J1.17 138.99,17.5 139.49,17 C24.P$2 | R8.P$1 C20.P$2 C17.P$2 C21.P$2 164,11.75 164,11.5
  pour Bottom (rank 2): 0,90 0,5 arc90 5,0 205,0 arc90 210,5 210,90 arc90 205,95 5,95 arc90
N$1
  pour Bottom (isolate 0.2): 162,64 162,31 arc90 167,26 200,26 arc90 205,31 205,64 arc90 200,69 167,69 arc90
N$2
  pour Bottom: 10,26 arc-90 5,31 5,64 arc-90 10,69 arc0 43,69 arc-90 48,64 48,31 arc-90 43,26
N$3
  pour Bottom (isolate 0.2): 197.75,19.7 arc-345 196.25,19.7 196.25,20.5 arc-180 197.75,20.5
N$4
  pour Bottom (isolate 0.2): 169.25,20.5 169.25,19.7 arc345 170.75,19.7 170.75,20.5 arc180
N$5
  pour Bottom (isolate 0.2): 184.25,19.7 arc-345 182.75,19.7 182.75,20.5 arc-180 184.25,20.5
N$6
  pour Bottom (isolate 0.2): 197.75,86.7 arc-345 196.25,86.7 196.25,87.5 arc-180 197.75,87.5
N$7
  pour Bottom (isolate 0.2): 144,2.8 66,2.8 arc-180 66,24.2 144,24.2 arc-180
N$8
  pour Bottom (isolate 0.2): 170.75,86.7 arc-345 169.25,86.7 169.25,87.5 arc-180 170.75,87.5
N$9
  pour Bottom (isolate 0.2): 182.75,87.5 182.75,86.7 arc345 184.25,86.7 184.25,87.5 arc180
N$10
  pour Bottom (isolate 0.2): 12.25,87.5 12.25,86.7 arc345 13.75,86.7 13.75,87.5 arc180
N$11
  pour Bottom (isolate 0.2): 39.25,87.5 39.25,86.7 arc345 40.75,86.7 40.75,87.5 arc180
N$12
  pour Bottom (isolate 0.2): 25.75,87.5 25.75,86.7 arc345 27.25,86.7 27.25,87.5 arc180
N$13
  pour Bottom (isolate 0.2): 39.25,20.5 39.25,19.7 arc345 40.75,19.7 40.75,20.5 arc180
N$14
  pour Bottom (isolate 0.2): 27.25,19.7 arc-345 25.75,19.7 25.75,20.5 arc-180 27.25,20.5
N$15
  pour Bottom: 10.23,18.74 arc107 8.33,16.2 arc-21 8.36,14.36 8.36,14.32 8.35,14.28 8.34,14.19 8.34,14.12 8.34,14.04 8.34,13.94 8.34,13.85 8.35,13.76 8.36,13.66 8.36,13.57 8.38,13.47 8.39,13.36 8.41,13.25 8.44,13.15 8.46,13.05 8.49,12.95 8.52,12.85 8.55,12.76 8.58,12.66 8.62,12.57 8.66,12.47 8.7,12.39 8.73,12.31 8.78,12.23 8.82,12.14 8.86,12.06 8.91,11.99 8.96,11.91 9.01,11.83 9.06,11.75 9.12,11.67 9.18,11.59 9.24,11.52 9.3,11.44 9.37,11.37 9.43,11.3 9.5,11.22 9.57,11.16 9.64,11.09 9.71,11.02 9.78,10.96 9.86,10.89 9.93,10.83 10.01,10.77 10.09,10.72 10.17,10.66 10.25,10.61 10.33,10.55 10.41,10.5 10.5,10.45 10.58,10.4 10.67,10.36 10.75,10.31 10.84,10.27 10.93,10.23 11.02,10.19 11.11,10.16 11.2,10.12 11.29,10.09 11.38,10.06 11.47,10.03 11.57,10 11.66,9.97 11.75,9.95 11.85,9.93 11.94,9.9 12.04,9.89 12.13,9.87 12.23,9.85 12.32,9.84 12.42,9.83 12.52,9.82 12.61,9.81 12.71,9.8 12.81,9.8 12.9,9.8 13,9.8 13.1,9.8 13.19,9.8 13.29,9.8 13.39,9.81 13.48,9.82 13.58,9.83 13.68,9.84 13.77,9.85 13.87,9.87 13.96,9.89 14.06,9.9 14.15,9.93 14.25,9.95 14.34,9.97 14.43,10 14.52,10.03 14.62,10.06 14.71,10.09 14.8,10.12 14.89,10.16 14.98,10.19 15.07,10.23 15.16,10.27 15.24,10.31 15.33,10.36 15.42,10.4 15.5,10.45 15.59,10.5 15.67,10.55 15.75,10.6 15.83,10.66 15.91,10.72 15.99,10.77 16.07,10.83 16.14,10.89 16.22,10.96 16.29,11.02 16.36,11.09 16.43,11.16 16.5,11.22 16.57,11.29 16.63,11.37 16.7,11.44 16.76,11.52 16.82,11.59 16.88,11.67 16.94,11.75 16.99,11.83 17.04,11.91 17.1,12 17.15,12.08 17.19,12.17 17.24,12.25 17.28,12.34 17.31,12.41 17.34,12.47 17.38,12.57 17.42,12.66 17.45,12.76 17.48,12.85 17.51,12.95 17.54,13.05 17.56,13.15 17.58,13.25 17.61,13.37 17.62,13.47 17.63,13.57 17.64,13.66 17.65,13.76 17.66,13.85 17.66,13.94 17.66,14.04 17.66,14.12 17.65,14.19 17.65,14.28 17.64,14.32 17.64,14.36 arc-21 17.67,16.2 arc106 15.77,18.74 13.75,18.74 13.75,20.5 arc180 12.25,20.5 12.25,18.74
N$16
  pour Bottom (isolate 0.2): 205,2.5 arc-90 202.5,5 arc-90 205,7.5 arc-90 207.5,5 arc-90
  pour Top (isolate 0.2): 205,2.5 arc-90 202.5,5 arc-90 205,7.5 arc-90 207.5,5 arc-90
N$17
  pour Bottom (isolate 0.2): 205,87.5 arc-90 202.5,90 arc-90 205,92.5 arc-90 207.5,90 arc-90
  pour Top (isolate 0.2): 205,87.5 arc-90 202.5,90 arc-90 205,92.5 arc-90 207.5,90 arc-90
N$18
  pour Bottom (isolate 0.2): 5,2.5 arc-90 2.5,5 arc-90 5,7.5 arc-90 7.5,5 arc-90
  pour Top (isolate 0.2): 5,2.5 arc-90 2.5,5 arc-90 5,7.5 arc-90 7.5,5 arc-90
N$19
  pour Bottom (isolate 0.2): 5,87.5 arc-90 2.5,90 arc-90 5,92.5 arc-90 7.5,90 arc-90
  pour Top (isolate 0.2): 5,87.5 arc-90 2.5,90 arc-90 5,92.5 arc-90 7.5,90 arc-90
N$20
  pour Top (rank 2): 0,90 0,5 arc90 5,0 205,0 arc90 210,5 210,90 arc90 205,95 5,95 arc90

### Text on the board
bPlace: C06 | C14 | C07 | C15 | C08 | R01 | C16 | R04 | R03 | C04 | R06 | C12 | C03 | C01 | C11 | C09 | R02 | C05 | R05 | C13 | C02 | C10 | IC01 | IC02 | C23 | C22 | C24 | R08 | R09 | C20 | C19 | C17 | R07 | C21 | C18 | IC03 | J01